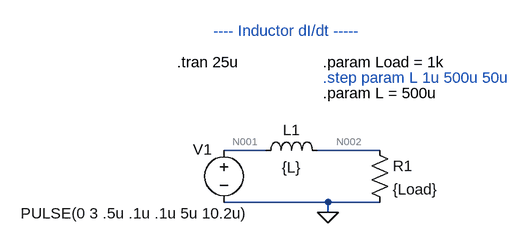
[diagram p0: schematic Inductor - dI.asc]
Inductor - dI.asc, the LTspice schematic file:
Version 4.1
SHEET 1 880 680
WIRE 144 144 80 144
WIRE 320 144 224 144
WIRE 240 224 80 224
WIRE 320 224 240 224
WIRE 240 240 240 224
FLAG 240 240 0
SYMBOL ind 128 160 R270
WINDOW 0 32 56 VTop 2
WINDOW 3 5 56 VBottom 2
SYMATTR InstName L1
SYMATTR Value {L}
SYMATTR SpiceLine Rser=1m
SYMBOL res 304 128 R0
SYMATTR InstName R1
SYMATTR Value {Load}
SYMBOL voltage 80 128 R0
WINDOW 0 -48 15 Left 2
WINDOW 3 -313 113 Left 2
WINDOW 123 0 0 Left 0
WINDOW 39 0 0 Left 0
SYMATTR InstName V1
SYMATTR Value PULSE(0 3 .5u .1u .1u 5u 10.2u)
TEXT 64 -40 Left 2 ;---- Inductor dI/dt -----
TEXT 232 32 Left 2 ;.step param L 1u 500u 50u
TEXT 232 8 Left 2 !.param Load = 1k
TEXT 8 8 Left 2 !.tran 25u
TEXT 232 56 Left 2 !.param L = 500u

The netlist it stands for:
* Inductor - dI.asc
L1 N001 N002 {L} Rser=1m
R1 N002 0 {Load}
V1 N001 0 PULSE(0 3 .5u .1u .1u 5u 10.2u)
* ---- Inductor dI/dt -----
* .step param L 1u 500u 50u
.param Load = 1k
.tran 25u
.param L = 500u
.backanno
.end

* Results of the author's LTspice run, read from the files saved beside the schematic
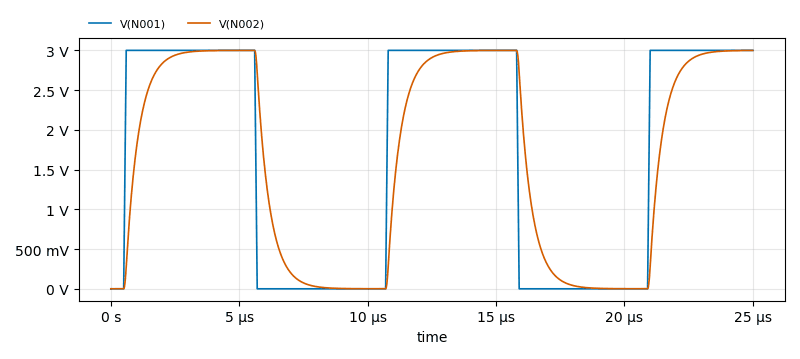
[diagram p1: Transient Analysis of Inductor - dI.asc, plotted from the saved traces]
* Transient Analysis, 1 run:
*   V(N001): min 0 V, max 3 V, average 1.71 V, rms 2.259 V, last 3 V
*   V(N002): min 0 V, max 3 V, average 1.65 V, rms 2.121 V, last 2.999 V